# Altium schematic sheet Sheet1.SchDoc
size A
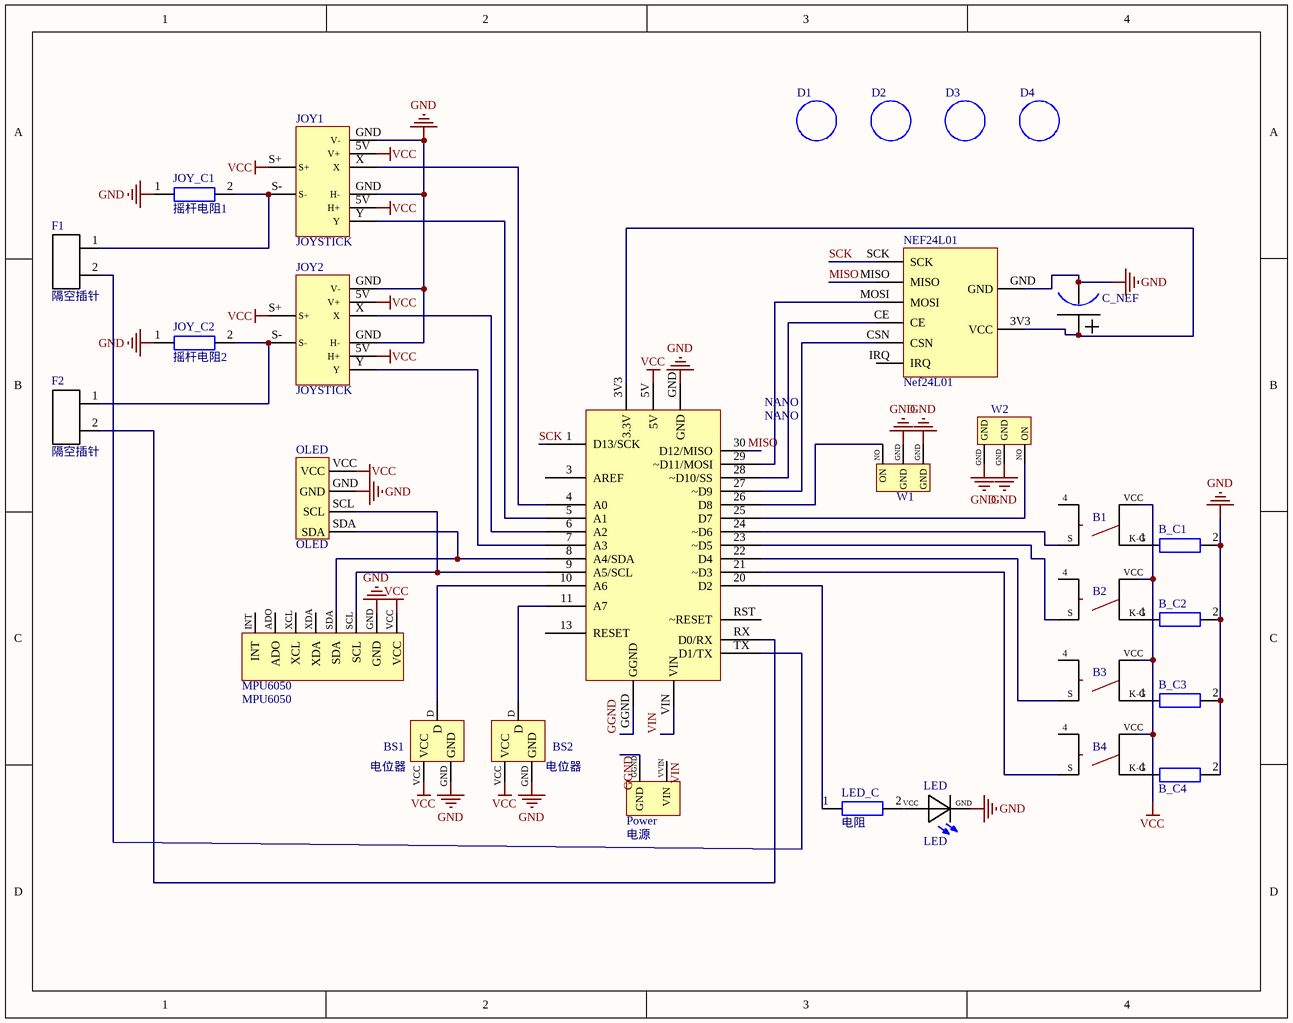
[diagram p0: Sheet1.SchDoc]

## Parts
B1  按键开关  [按键开关]  (value not drawn)
B2  按键开关  [按键开关]  (value not drawn)
B3  按键开关  [按键开关]  (value not drawn)
B4  按键开关  [按键开关]  (value not drawn)
B_C1  电阻  [0805]  (value not drawn)
B_C2  电阻  [0805]  (value not drawn)
B_C3  电阻  [0805]  (value not drawn)
B_C4  电阻  [0805]  (value not drawn)
BS1  电位器  [WH148]
BS2  电位器  [WH148]
C_NEF  电容  [电容]  (value not drawn)
D1  定位孔  [散热孔]  (value not drawn)
D2  定位孔  [散热孔]  (value not drawn)
D3  定位孔  [散热孔]  (value not drawn)
D4  定位孔  [散热孔]  (value not drawn)
F1  隔空插针  [跳线帽]
F2  隔空插针  [跳线帽]
JOY1  JOYSTICK  [摇杆]
JOY2  JOYSTICK  [摇杆]
JOY_C1  摇杆电阻1  [0805]
JOY_C2  摇杆电阻2  [0805]
LED  LED  [1206]
LED_C  电阻  [0805]
MPU6050  MPU6050  [MPU6050]
NANO  NANO  [NANO]
NEF24L01  Nef24L01  [Nef24L01]
OLED  OLED  [OLED]
Power  电源  [电源]
W1  拨动开关  [拨动开关]  (value not drawn)
W2  拨动开关  [拨动开关]  (value not drawn)

## Nets
GND: B_C1.2 B_C2.2 B_C3.2 B_C4.2 BS1.GND BS2.GND C_NEF.GND JOY1.GND(H-) JOY2.GND(H-) JOY_C1.1 JOY_C2.1 LED.GND MPU6050.GND NANO.GND NEF24L01.GND OLED.GND W1.GND W2.GND
VCC: B1.VCC B2.VCC B3.VCC B4.VCC BS1.VCC BS2.VCC JOY1.5V(H+) JOY1.S+ JOY2.5V(H+) JOY2.S+ MPU6050.VCC NANO.5V OLED.VCC
GGND: NANO.GGND Power.GGND(GND)
MISO: NANO.30(D12/MISO) NEF24L01.MISO
SCK: NANO.1(D13/SCK) NEF24L01.SCK
VIN: NANO.VIN Power.VVIN(VIN)
NetB1_K-G: B1.K-G B_C1.1
NetB1_S: B1.S NANO.24(~D6)
NetB2_K-G: B2.K-G B_C2.1
NetB2_S: B2.S NANO.23(~D5)
NetB3_K-G: B3.K-G B_C3.1
NetB3_S: B3.S NANO.22(D4)
NetB4_K-G: B4.K-G B_C4.1
NetB4_S: B4.S NANO.21(~D3)
NetBS1_D: BS1.D NANO.10(A6)
NetBS2_D: BS2.D NANO.11(A7)
NetC_NEF_3V3: C_NEF.3V3(+) NANO.3V3(3.3V) NEF24L01.3V3(VCC)
NetF1_1: F1.1 JOY1.S- JOY_C1.2
NetF1_2: F1.2 NANO.TX(D1/TX)
NetF2_1: F2.1 JOY2.S- JOY_C2.2
NetF2_2: F2.2 NANO.RX(D0/RX)
NetJOY1_X: JOY1.X NANO.4(A0)
NetJOY1_Y: JOY1.Y NANO.5(A1)
NetJOY2_X: JOY2.X NANO.6(A2)
NetJOY2_Y: JOY2.Y NANO.7(A3)
NetLED_C_1: LED_C.1 NANO.20(D2)
NetLED_VCC: LED.VCC LED_C.2
NetMPU6050_SCL: MPU6050.SCL NANO.9(A5/SCL) OLED.SCL
NetMPU6050_SDA: MPU6050.SDA NANO.8(A4/SDA) OLED.SDA
NetNANO_25: NANO.25(D7) W2.NO(ON)
NetNANO_26: NANO.26(D8) W1.NO(ON)
NetNANO_27: NANO.27(~D9) NEF24L01.CSN
NetNANO_28: NANO.28(~D10/SS) NEF24L01.CE
NetNANO_29: NANO.29(~D11/MOSI) NEF24L01.MOSI

Not connected (* = marked no-connect by the designer): B1 4(2); B2 4(2); B3 4(2); B4 4(2); MPU6050 ADO INT XCL XDA; NANO 3(AREF) 13(RESET) RST(~RESET); NEF24L01 IRQ

## Library data of the parts
B1-B4 = 按键开关: 自复位
BS1 BS2 = 电位器: S/V/G
JOY1 JOY2 = JOYSTICK: PS摇杆
JOY_C1 JOY_C2 = 电阻
MPU6050 = MPU6050: 加速度计
NANO = NANO: Arduino
NEF24L01 = Nef24L01: board
OLED = OLED: 0.96